# Altium schematic sheet MXM 3.1 Connector Interface.SchDoc
size Tabloid; DrawnBy: Krutav Shah; SheetNumber: 4; SheetTotal: 6
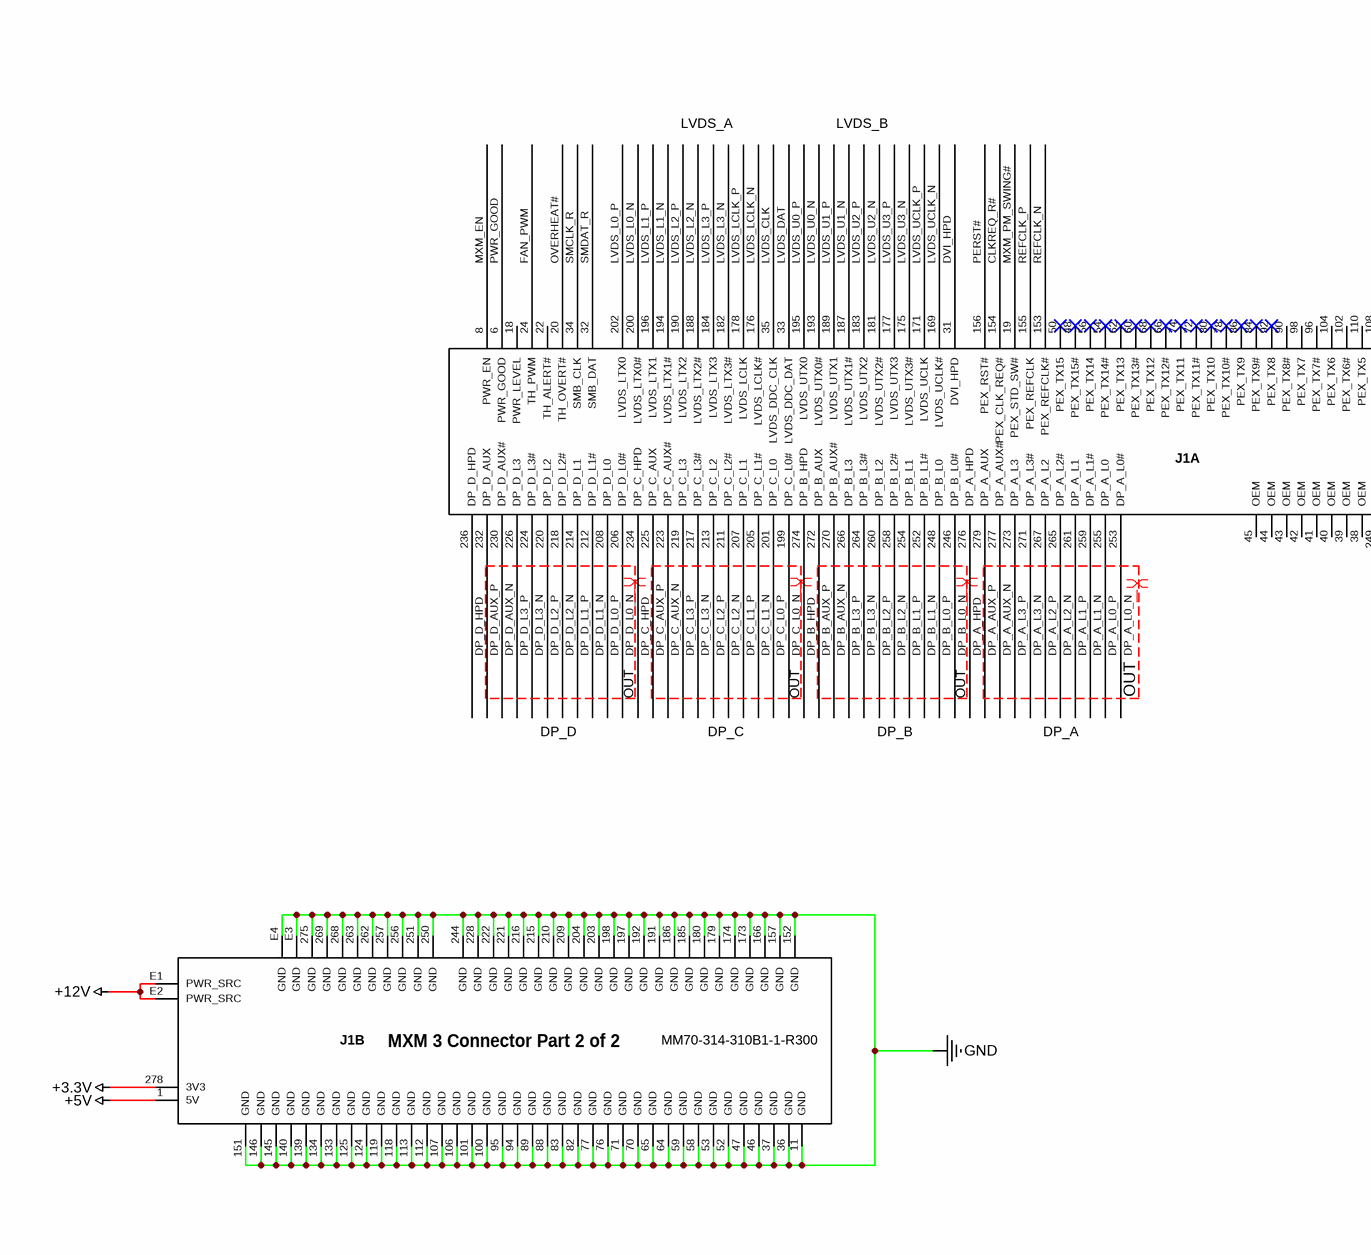
[diagram p0: MXM 3.1 Connector Interface.SchDoc, left]
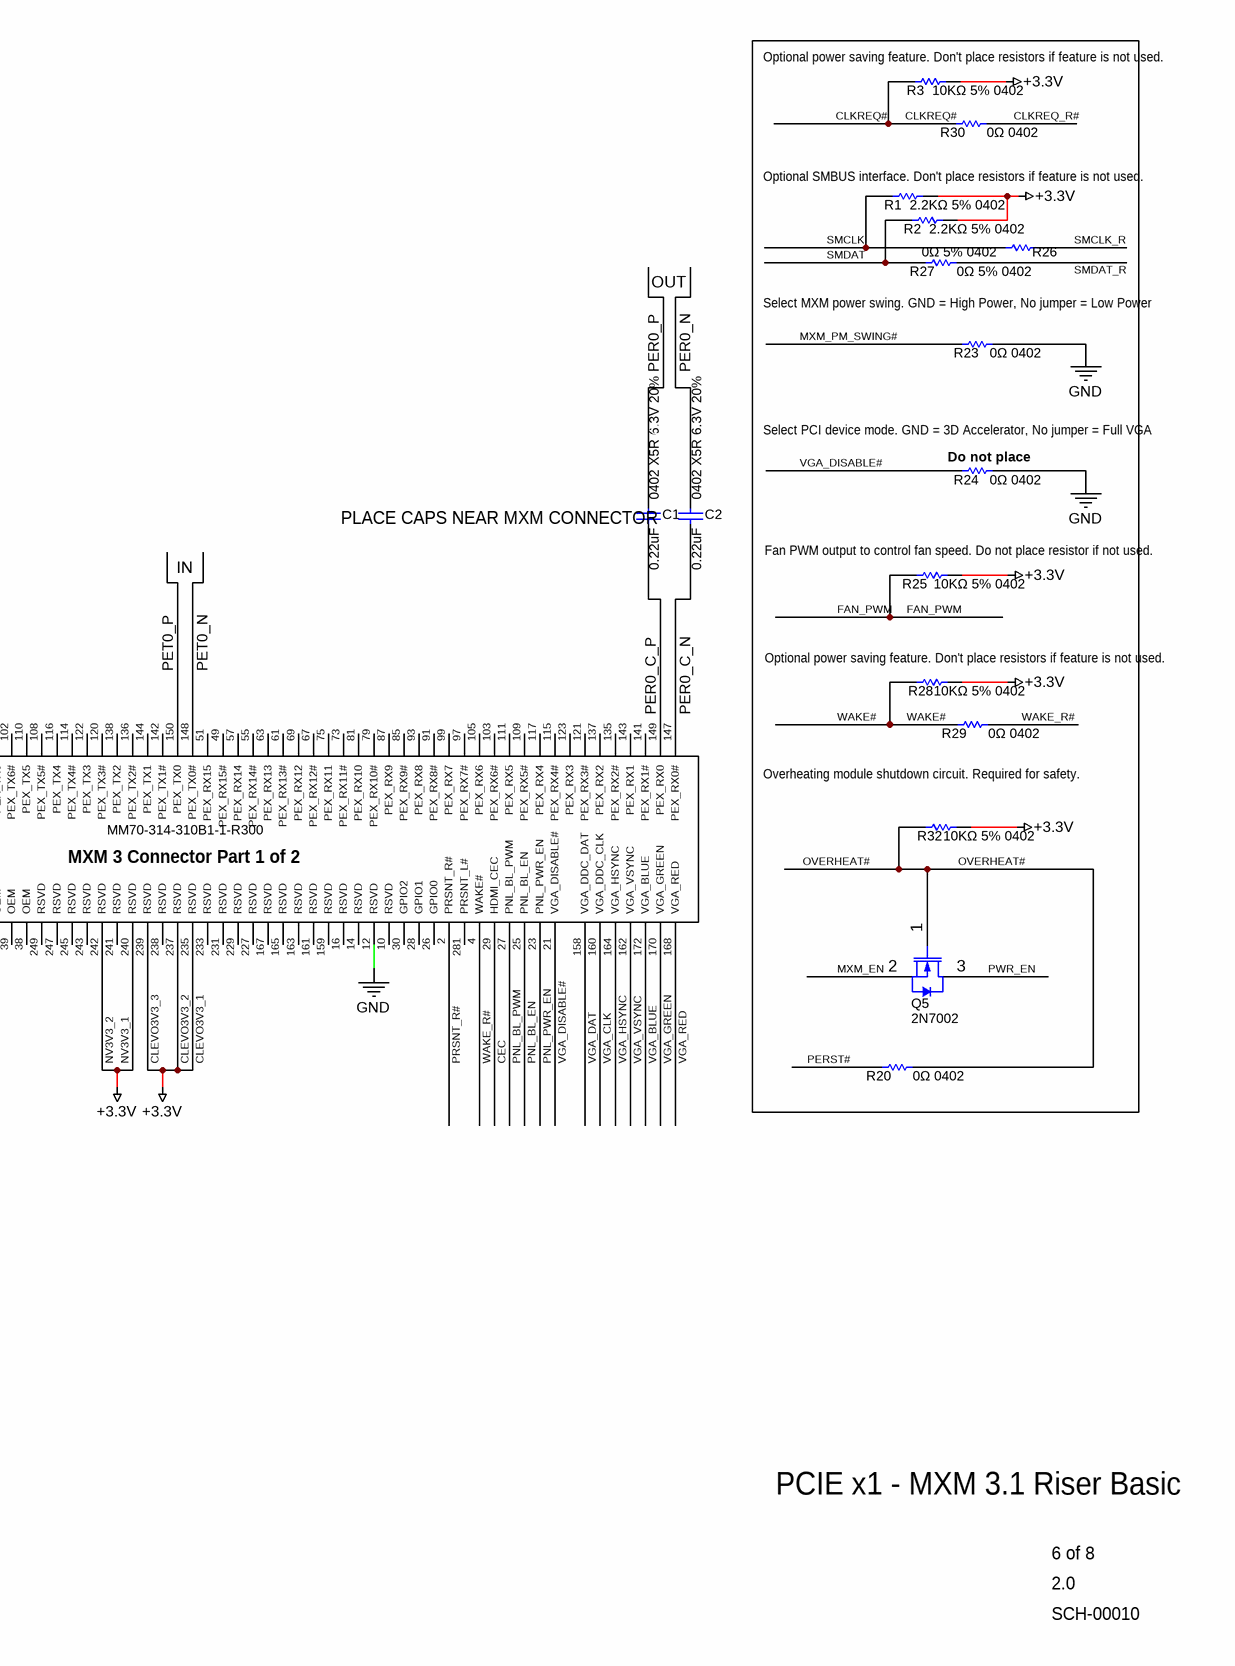
[diagram p1: MXM 3.1 Connector Interface.SchDoc, right]

## Parts
C1  0.22uF       0402 X5R 6.3V 20%  [CAPC0603X33X15NL03T05]
C2  0.22uF       0402 X5R 6.3V 20%  [CAPC0603X33X15NL03T05]
J1  MM70-314-310B1-1-R300  [JAE_MM70-314-310B1-2-R300]  (parts A,B of 2)
Q5  2N7002  [INF-PG-SOT23_M]
R1  2.2KΩ 5% 0402  [RESC0201(0603)_L]
R2  2.2KΩ 5% 0402  [RESC0201(0603)_L]
R3  10KΩ 5% 0402  [RESC0201(0603)_L]
R20  0Ω 0402  [RESC0201(0603)_L]
R23  0Ω 0402  [RESC0201(0603)_L]
R24  0Ω 0402  [RESC0201(0603)_L]
R25  10KΩ 5% 0402  [RESC0201(0603)_L]
R26  0Ω 5% 0402  [RESC0201(0603)_L]
R27  0Ω 5% 0402  [RESC0201(0603)_L]
R28  10KΩ 5% 0402  [RESC0201(0603)_L]
R29  0Ω 0402  [RESC0201(0603)_L]
R30  0Ω 0402  [RESC0201(0603)_L]
R32  10KΩ 5% 0402  [RESC0201(0603)_L]

## Nets
+5V: J1.1(5V)
+12V: J1.E1(PWR_SRC) J1.E2(PWR_SRC)
CLEVO3V3_1: J1.235(RSVD) J1.237(RSVD) J1.239(RSVD) J1.240(RSVD) J1.242(RSVD) J1.278(3V3) R1.1 R2.1 R3.1 R25.1 R28.1 R32.1  [also labelled +3.3V, CLEVO3V3_2, CLEVO3V3_3, NV3V3_1, NV3V3_2]
GND: J1.11(GND) J1.12(RSVD) J1.36(GND) J1.37(GND) J1.46(GND) J1.47(GND) J1.52(GND) J1.53(GND) J1.58(GND) J1.59(GND) J1.64(GND) J1.65(GND) J1.70(GND) J1.71(GND) J1.76(GND) J1.77(GND) J1.82(GND) J1.83(GND) J1.88(GND) J1.89(GND) J1.94(GND) J1.95(GND) J1.100(GND) J1.101(GND) J1.106(GND) J1.107(GND) J1.112(GND) J1.113(GND) J1.118(GND) J1.119(GND) J1.124(GND) J1.125(GND) J1.133(GND) J1.134(GND) J1.139(GND) J1.140(GND) J1.145(GND) J1.146(GND) J1.151(GND) J1.152(GND) J1.157(GND) J1.166(GND) J1.173(GND) J1.174(GND) J1.179(GND) J1.180(GND) J1.185(GND) J1.186(GND) J1.191(GND) J1.192(GND) J1.197(GND) J1.198(GND) J1.203(GND) J1.204(GND) J1.209(GND) J1.210(GND) J1.215(GND) J1.216(GND) J1.221(GND) J1.222(GND) J1.228(GND) J1.244(GND) J1.250(GND) J1.251(GND) J1.256(GND) J1.257(GND) J1.262(GND) J1.263(GND) J1.268(GND) J1.269(GND) J1.275(GND) J1.E3(GND) J1.E4(GND) R23.1 R24.1
CEC: J1.29(HDMI_CEC)
CLKREQ#: R3.2 R30.2
CLKREQ_R#: J1.154(PEX_CLK_REQ#) R30.1
DP_A_AUX_N: J1.277(DP_A_AUX#)
DP_A_AUX_P: J1.279(DP_A_AUX)
DP_A_HPD: J1.276(DP_A_HPD)
DP_A_L0_N: J1.253(DP_A_L0#)
DP_A_L0_P: J1.255(DP_A_L0)
DP_A_L1_N: J1.259(DP_A_L1#)
DP_A_L1_P: J1.261(DP_A_L1)
DP_A_L2_N: J1.265(DP_A_L2#)
DP_A_L2_P: J1.267(DP_A_L2)
DP_A_L3_N: J1.271(DP_A_L3#)
DP_A_L3_P: J1.273(DP_A_L3)
DP_B_AUX_N: J1.270(DP_B_AUX#)
DP_B_AUX_P: J1.272(DP_B_AUX)
DP_B_HPD: J1.274(DP_B_HPD)
DP_B_L0_N: J1.246(DP_B_L0#)
DP_B_L0_P: J1.248(DP_B_L0)
DP_B_L1_N: J1.252(DP_B_L1#)
DP_B_L1_P: J1.254(DP_B_L1)
DP_B_L2_N: J1.258(DP_B_L2#)
DP_B_L2_P: J1.260(DP_B_L2)
DP_B_L3_N: J1.264(DP_B_L3#)
DP_B_L3_P: J1.266(DP_B_L3)
DP_C_AUX_N: J1.223(DP_C_AUX#)
DP_C_AUX_P: J1.225(DP_C_AUX)
DP_C_HPD: J1.234(DP_C_HPD)
DP_C_L0_N: J1.199(DP_C_L0#)
DP_C_L0_P: J1.201(DP_C_L0)
DP_C_L1_N: J1.205(DP_C_L1#)
DP_C_L1_P: J1.207(DP_C_L1)
DP_C_L2_N: J1.211(DP_C_L2#)
DP_C_L2_P: J1.213(DP_C_L2)
DP_C_L3_N: J1.217(DP_C_L3#)
DP_C_L3_P: J1.219(DP_C_L3)
DP_D_AUX_N: J1.230(DP_D_AUX#)
DP_D_AUX_P: J1.232(DP_D_AUX)
DP_D_HPD: J1.236(DP_D_HPD)
DP_D_L0_N: J1.206(DP_D_L0#)
DP_D_L0_P: J1.208(DP_D_L0)
DP_D_L1_N: J1.212(DP_D_L1#)
DP_D_L1_P: J1.214(DP_D_L1)
DP_D_L2_N: J1.218(DP_D_L2#)
DP_D_L2_P: J1.220(DP_D_L2)
DP_D_L3_N: J1.224(DP_D_L3#)
DP_D_L3_P: J1.226(DP_D_L3)
DVI_HPD: J1.31(DVI_HPD)
FAN_PWM: J1.24(TH_PWM) R25.2
LVDS_CLK: J1.35(LVDS_DDC_CLK)
LVDS_DAT: J1.33(LVDS_DDC_DAT)
LVDS_L0_N: J1.200(LVDS_LTX0#)
LVDS_L0_P: J1.202(LVDS_LTX0)
LVDS_L1_N: J1.194(LVDS_LTX1#)
LVDS_L1_P: J1.196(LVDS_LTX1)
LVDS_L2_N: J1.188(LVDS_LTX2#)
LVDS_L2_P: J1.190(LVDS_LTX2)
LVDS_L3_N: J1.182(LVDS_LTX3#)
LVDS_L3_P: J1.184(LVDS_LTX3)
LVDS_LCLK_N: J1.176(LVDS_LCLK#)
LVDS_LCLK_P: J1.178(LVDS_LCLK)
LVDS_U0_N: J1.193(LVDS_UTX0#)
LVDS_U0_P: J1.195(LVDS_UTX0)
LVDS_U1_N: J1.187(LVDS_UTX1#)
LVDS_U1_P: J1.189(LVDS_UTX1)
LVDS_U2_N: J1.181(LVDS_UTX2#)
LVDS_U2_P: J1.183(LVDS_UTX2)
LVDS_U3_N: J1.175(LVDS_UTX3#)
LVDS_U3_P: J1.177(LVDS_UTX3)
LVDS_UCLK_N: J1.169(LVDS_UCLK#)
LVDS_UCLK_P: J1.171(LVDS_UCLK)
MXM_EN: J1.8(PWR_EN) Q5.2(SOURCE)
MXM_PM_SWING#: J1.19(PEX_STD_SW#) R23.2
OVERHEAT#: J1.20(TH_OVERT#) Q5.1(GATE) R20.1 R32.2
PER0_C_N: C2.1 J1.147(PEX_RX0#)
PER0_C_P: C1.1 J1.149(PEX_RX0)
PER0_N: C2.2
PER0_P: C1.2
PERST#: J1.156(PEX_RST#) R20.2
PET0_N: J1.148(PEX_TX0#)
PET0_P: J1.150(PEX_TX0)
PNL_BL_EN: J1.25(PNL_BL_EN)
PNL_BL_PWM: J1.27(PNL_BL_PWM)
PNL_PWR_EN: J1.23(PNL_PWR_EN)
PRSNT_R#: J1.2(PRSNT_R#)
PWR_EN: Q5.3(DRAIN)
PWR_GOOD: J1.6(PWR_GOOD)
REFCLK_N: J1.153(PEX_REFCLK#)
REFCLK_P: J1.155(PEX_REFCLK)
SMCLK: R1.2 R26.2
SMCLK_R: J1.34(SMB_CLK) R26.1
SMDAT: R2.2 R27.2
SMDAT_R: J1.32(SMB_DAT) R27.1
VGA_BLUE: J1.172(VGA_BLUE)
VGA_CLK: J1.160(VGA_DDC_CLK)
VGA_DAT: J1.158(VGA_DDC_DAT)
VGA_DISABLE#: J1.21(VGA_DISABLE#) R24.2
VGA_GREEN: J1.170(VGA_GREEN)
VGA_HSYNC: J1.164(VGA_HSYNC)
VGA_RED: J1.168(VGA_RED)
VGA_VSYNC: J1.162(VGA_VSYNC)
WAKE#: R28.2 R29.2
WAKE_R#: J1.4(WAKE#) R29.1

Not connected (* = marked no-connect by the designer): J1 10(RSVD) 14(RSVD) 16(RSVD) 18(PWR_LEVEL) 22(TH_ALERT#) 26(GPIO0) 28(GPIO1) 30(GPIO2) 38(OEM) 39(OEM) 40(OEM) 41(OEM) 42(OEM) 43(OEM) 44(OEM) 45(OEM) 48(PEX_TX15#)* 49(PEX_RX15#) 50(PEX_TX15)* 51(PEX_RX15) 54(PEX_TX14#)* 55(PEX_RX14#) 56(PEX_TX14)* 57(PEX_RX14) 60(PEX_TX13#)* 61(PEX_RX13#) 62(PEX_TX13)* 63(PEX_RX13) 66(PEX_TX12#)* 67(PEX_RX12#) 68(PEX_TX12)* 69(PEX_RX12) 72(PEX_TX11#)* 73(PEX_RX11#) 74(PEX_TX11)* 75(PEX_RX11) 78(PEX_TX10#)* 79(PEX_RX10#) 80(PEX_TX10)* 81(PEX_RX10) 84(PEX_TX9#)* 85(PEX_RX9#) 86(PEX_TX9)* 87(PEX_RX9) 90(PEX_TX8#) 91(PEX_RX8#) 92(PEX_TX8)* 93(PEX_RX8) 96(PEX_TX7#) 97(PEX_RX7#) 98(PEX_TX7) 99(PEX_RX7) 102(PEX_TX6#) 103(PEX_RX6#) 104(PEX_TX6) 105(PEX_RX6) 108(PEX_TX5#) 109(PEX_RX5#) 110(PEX_TX5) 111(PEX_RX5) 114(PEX_TX4#) 115(PEX_RX4#) 116(PEX_TX4) 117(PEX_RX4) 120(PEX_TX3#) 121(PEX_RX3#) 122(PEX_TX3) 123(PEX_RX3) 135(PEX_RX2#) 136(PEX_TX2#) 137(PEX_RX2) 138(PEX_TX2) 141(PEX_RX1#) 142(PEX_TX1#) 143(PEX_RX1) 144(PEX_TX1) 159(RSVD) 161(RSVD) 163(RSVD) 165(RSVD) 167(RSVD) 227(RSVD) 229(RSVD) 231(RSVD) 233(RSVD) 238(RSVD) 241(RSVD) 243(RSVD) 245(RSVD) 247(RSVD) 249(RSVD) 281(PRSNT_L#)

## Layout directives
differential pair: DP_A_AUX_N, DP_A_AUX_P, DP_A_L0_N, DP_A_L0_P, DP_A_L1_N, DP_A_L1_P, DP_A_L2_N, DP_A_L2_P, DP_A_L3_N, DP_A_L3_P, DP_B_AUX_N, DP_B_AUX_P, DP_B_L0_N, DP_B_L0_P, DP_B_L1_N, DP_B_L1_P, DP_B_L2_N, DP_B_L2_P, DP_B_L3_N, DP_B_L3_P, DP_C_AUX_N, DP_C_AUX_P, DP_C_L0_N, DP_C_L0_P, DP_C_L1_N, DP_C_L1_P, DP_C_L2_N, DP_C_L2_P, DP_C_L3_N, DP_C_L3_P, DP_D_AUX_N, DP_D_AUX_P, DP_D_L0_N, DP_D_L0_P, DP_D_L1_N, DP_D_L1_P, DP_D_L2_N, DP_D_L2_P, DP_D_L3_N, DP_D_L3_P, LVDS_L0_N, LVDS_L0_P, LVDS_L1_N, LVDS_L1_P, LVDS_L2_N, LVDS_L2_P, LVDS_L3_N, LVDS_L3_P, LVDS_LCLK_N, LVDS_LCLK_P, LVDS_U0_N, LVDS_U0_P, LVDS_U1_N, LVDS_U1_P, LVDS_U2_N, LVDS_U2_P, LVDS_U3_N, LVDS_U3_P, LVDS_UCLK_N, LVDS_UCLK_P, PER0_C_N, PER0_C_P, PER0_N, PER0_P, PET0_N, PET0_P, REFCLK_N, REFCLK_P

## Notes on the sheet
- (near R3) Optional power saving feature. Don't place resistors if feature is not used.
- (near R1) Optional SMBUS interface. Don't place resistors if feature is not used.
- OUT
- Select MXM power swing. GND = High Power, No jumper = Low Power
- (near R24) Select PCI device mode. GND = 3D Accelerator, No jumper = Full VGA
- (near R24) Do not place
- LVDS_A
- LVDS_B
- (near C1) PLACE CAPS NEAR MXM CONNECTOR
- (near R25) Fan PWM output to control fan speed. Do not place resistor if not used.
- IN
- (near R28) Optional power saving feature. Don't place resistors if feature is not used.
- Overheating module shutdown circuit. Required for safety.
- DP_D
- DP_C
- DP_B
- DP_A
- PCIE x1 - MXM 3.1 Riser Basic
- 6 of 8
- 2.0
- SCH-00010
- Last Modified:
- Krutav.com
- The Krutav Shah Company
- US-Tabloid
- SIZE:
- SHEET:
- This document and its contents are the property of The Krutav Shah Company. The posessor of this document agrees to the following:
- Proprietary Property Notice:
- 1. Do not distrubte without authorization.
- 3. Use for the purposes of evaluation only.
- 2. Not to reproduce or copy the contents of.
- 4. The Krutav Shah Company reserves all rights.
- Revision:
- Inventory #:
- (in symbol MM70-314-310B1-1-R300, part A) MXM 3 Connector Part 1 of 2
- (in symbol MM70-314-310B1-1-R300, part B) MXM 3 Connector Part 2 of 2

## Library data of the parts
C1 C2 = CMP-2010-00679-1: Manufacturer: Samsung; Part Number: CL03A224MQ3NNNC
J1 = MM70-314-310B1-1-R300: 314 Position Female Connector MXM 3.0 Gold 0.020 _0.50mm_ Black; MF: JAE Electronics; Package: None; Digi-Key_Part_Number: 670-2431-1-ND; Digi-Key_Purchase_URL: https://www.digikey.com/product-detail/en/jae-electronics/MM70-314-310B1-1-R300/670-2431-1-ND/2183605?utm_source=snapeda&utm_medium=aggregator&utm_campaign=symbol; Value: *; MP: MM70-314-310B1-1-R300; SnapEDA_Link: https://www.snapeda.com/parts/MM70-314-310B1-1-R300/JAE%20Electronics/view-part/553386/?ref=snap
Q5 = CMP-1149-00026-1: N-Channel OptiMOS Small-Signal-Transistor, 60 V VDS, 0.3 A ID, -55 to 150 degC, PG-SOT23, Reel, Green; Manufacturer: Infineon; RDS (on) (max) (@4.5V): 4,000 mOhm; VDS (max): 60 V; IDpuls (max): 1.2Â A; QG: 0.4Â nC; RDS (on) (max): 3,000 mOhm; RthJA (max): 250 K/W; ID (max): 0.3Â A; VGS(th) (max): 2.5Â V; VGS(th) (min): 1.5Â V; Green: TRUE; Ptot (max): 0.5Â W; PackageDescription: 3-Pin Small Outline Transistor Package, 2.9 x 1.3 mm Body, 0.95 mm Pitch; Halogen-free: TRUE; ComponentLink2Description: Datasheet; ComponentLink1URL: http://www.infineon.com/; Packing: Reel; DatasheetVersion: Rev. 2.4; PartNumber: 2N7002; PackageReference: PG-SOT23; PackageVersion: Apr-08; ComponentLink3URL: http://www.infineon.com/dgdl/SOT23-Package_Overview.pdf?folderId=db3a30431936bc4b0119532290053c66&fileId=db3a30431936bc4b0119533468123c85; ComponentLink1Description: Manufacturer URL; Mounting Technology: Surface Mount; ComponentLink3Description: Package Specification; ComponentLink2URL: http://www.infineon.com/dgdl/2N7002_Rev2.4.pdf?folderId=db3a3043156fd573011622e10b5c1f67&fileId=db3a304319bc939a0119c2a9461e79e6
R1-R3 R20 R23-R30 R32 = CMP-1010-00755-1: 1M 0.05W 1% 0201 (0603 Metric)  SMD; Case-Metric: 0603; Value: 1000000.00 Ohm; Case-EIA: 0201; Technology: SMT; Tolerance: 1 %; Power: 0.05 W